# Altium project SmallyMouse2.PrjPcb
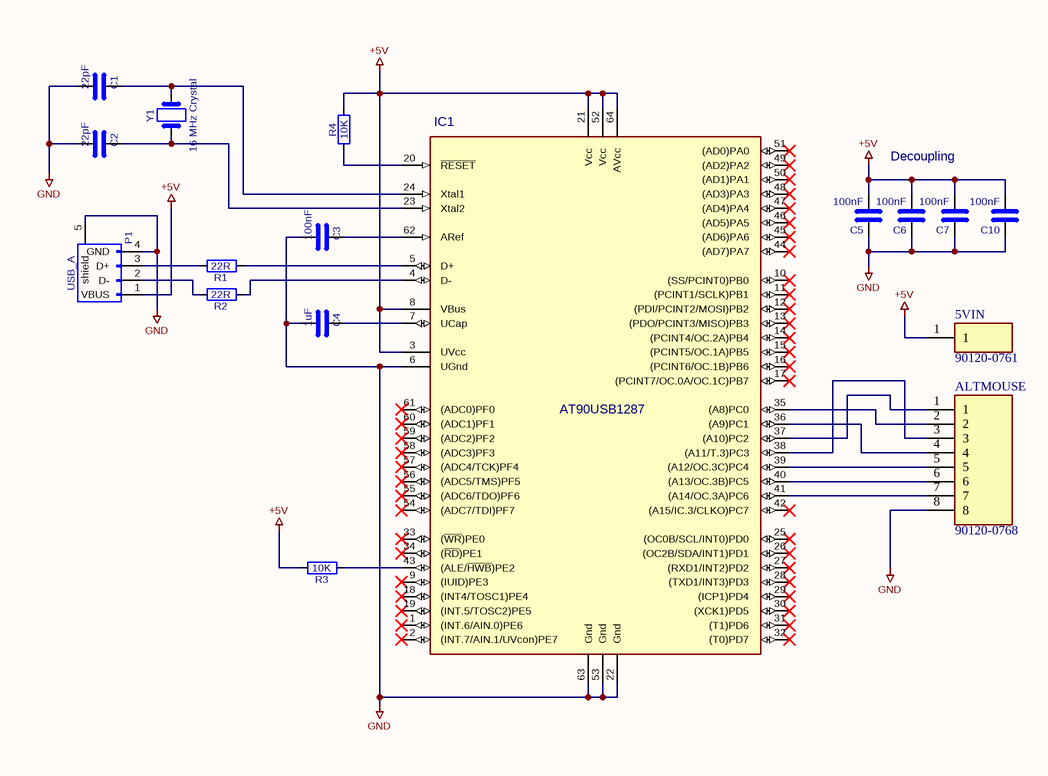
[diagram p0: SmallyMouse2.SchDoc]
1 sheet, 17 parts. Net scope: global (net labels, ports and power ports of the same name join across sheets).
Board file: SmallyMouse2.PcbDoc

## Sheet SmallyMouse2.SchDoc
size 297 x 210 mm

### Parts
5VIN  90120-0761  [HDRV1W90P0X254_1X1_232X249X560P]
ALTMOUSE  90120-0768  [HDRV8W90P0X254_1X8_2032X249X560P]
C1  22pF  [C_0805_HandSoldering]
C2  22pF  [C_0805_HandSoldering]
C3  100nF  [C_0805_HandSoldering]
C4  1uF  [C_0805_HandSoldering]
C5  100nF  [C_0805_HandSoldering]
C6  100nF  [C_0805_HandSoldering]
C7  100nF  [C_0805_HandSoldering]
C10  100nF  [C_0805_HandSoldering]
IC1  AT90USB1287  [TQFP-64_14x14mm_Pitch0.8mm]
P1  USB_A  [Amphenol_87583-2010BLF]
R1  22R  [R_0805_HandSoldering]
R2  22R  [R_0805_HandSoldering]
R3  10K  [R_0805_HandSoldering]
R4  10K  [R_0805_HandSoldering]
Y1  16 MHz Crystal  [Crystal_SMD_5032-2pin_5.0x3.2mm_HandSoldering]

### Nets
+5V: 5VIN.1 C5.2 C6.2 C7.2 C10.2 IC1.3(UVcc) IC1.8(VBus) IC1.21(Vcc) IC1.52(Vcc) IC1.64(AVcc) P1.1(VBUS) R3.2 R4.2
GND: ALTMOUSE.8 C1.2 C2.2 C3.2 C4.2 C5.1 C6.1 C7.1 C10.1 IC1.6(UGnd) IC1.22(Gnd) IC1.53(Gnd) IC1.63(Gnd) P1.4(GND) P1.5(shield)
NetALTMOUSE_1: ALTMOUSE.1 IC1.37((A10)PC2)
NetALTMOUSE_2: ALTMOUSE.2 IC1.35((A8)PC0)
NetALTMOUSE_3: ALTMOUSE.3 IC1.38((A11/T.3)PC3)
NetALTMOUSE_4: ALTMOUSE.4 IC1.36((A9)PC1)
NetALTMOUSE_5: ALTMOUSE.5 IC1.39((A12/OC.3C)PC4)
NetALTMOUSE_6: ALTMOUSE.6 IC1.40((A13/OC.3B)PC5)
NetALTMOUSE_7: ALTMOUSE.7 IC1.41((A14/OC.3A)PC6)
NetC1_1: C1.1 IC1.24(Xtal1) Y1.2
NetC2_1: C2.1 IC1.23(Xtal2) Y1.1
NetC3_1: C3.1 IC1.62(ARef)
NetC4_1: C4.1 IC1.7(UCap)
NetIC1_4: IC1.4(D-) R2.1
NetIC1_5: IC1.5(D+) R1.1
NetIC1_20: IC1.20(~{RESET}) R4.1
NetIC1_43: IC1.43((ALE/~{HWB})PE2) R3.1
NetP1_2: P1.2(D-) R2.2
NetP1_3: P1.3(D+) R1.2

Not connected (* = marked no-connect by the designer): IC1 1((INT.6/AIN.0)PE6)* 2((INT.7/AIN.1/UVcon)PE7)* 9((IUID)PE3)* 10((SS/PCINT0)PB0)* 11((PCINT1/SCLK)PB1)* 12((PDI/PCINT2/MOSI)PB2)* 13((PDO/PCINT3/MISO)PB3)* 14((PCINT4/OC.2A)PB4)* 15((PCINT5/OC.1A)PB5)* 16((PCINT6/OC.1B)PB6)* 17((PCINT7/OC.0A/OC.1C)PB7)* 18((INT4/TOSC1)PE4)* 19((INT.5/TOSC2)PE5)* 25((OC0B/SCL/INT0)PD0)* 26((OC2B/SDA/INT1)PD1)* 27((RXD1/INT2)PD2)* 28((TXD1/INT3)PD3)* 29((ICP1)PD4)* 30((XCK1)PD5)* 31((T1)PD6)* 32((T0)PD7)* 33((~{WR})PE0)* 34((~{RD})PE1)* 42((A15/IC.3/CLKO)PC7)* 44((AD7)PA7)* 45((AD6)PA6)* 46((AD5)PA5)* 47((AD4)PA4)* 48((AD3)PA3)* 49((AD2)PA2)* 50((AD1)PA1)* 51((AD0)PA0)* 54((ADC7/TDI)PF7)* 55((ADC6/TDO)PF6)* 56((ADC5/TMS)PF5)* 57((ADC4/TCK)PF4)* 58((ADC3)PF3)* 59((ADC2)PF2)* 60((ADC1)PF1)* 61((ADC0)PF0)*

### Notes on the sheet
- Decoupling
- 1
- 2
- 3
- 4
- 5
- 6
- A
- B
- C
- (c)2017 Simon Inns
- License: Attribution-ShareAlike 4.0 International (CC BY-SA 4.0)
- D
- Title: SmallyMouse2
- File: SmallyMouse2.sch
- Sheet: /
- http://www.WaitingForFriday.com
- KiCad E.D.A.  kicad (5.1.4)-1
- Size: A4
- Date: 2017-02-16
- Rev: 2.0
- Id: 1/1

### Library data of the parts
5VIN = 90120-0761: Connector; Manufacturer_Name: Molex; Datasheet Link: https://www.molex.com/pdm_docs/sd/901200761_sd.pdf; Height: 5.6mm; Manufacturer_Part_Number: 90120-0761; Mouser Part Number: 538-90120-0761; Mouser Price/Stock: https://www.mouser.co.uk/ProductDetail/Molex/90120-0761?qs=PvP5v7Eimsn%2F58TpDaAAow%3D%3D
ALTMOUSE = 90120-0768: Connector; Manufacturer_Name: Molex; Datasheet Link: http://www.molex.com/molex/products/datasheet.jsp?part=active/0901200768_PCB_HEADERS.xml; Height: 5.6mm; Manufacturer_Part_Number: 90120-0768; Mouser Part Number: 538-90120-0768; Mouser Price/Stock: https://www.mouser.co.uk/ProductDetail/Molex/90120-0768?qs=PvP5v7EimsmChj6ovxYE3w%3D%3D; Arrow Part Number: 90120-0768; Arrow Price/Stock: http://www.arrow.com/en/products/90120-0768/molex
C1-C7 C10 = C: Footprint: Capacitors_SMD:C_0805_HandSoldering
  C1 C2: Value: 22pF
  C3 C5-C7 C10: Value: 100nF
  C4: Value: 1uF
IC1 = AT90USB1287-RESCUE-SmallyMouse2: Value: AT90USB1287; Footprint: Housings_QFP:TQFP-64_14x14mm_Pitch0.8mm
P1 = USB_A-RESCUE-SmallyMouse2: Value: USB_A; Footprint: SimonsFPLibrary2017:Amphenol_87583-2010BLF
R1-R4 = R: Footprint: Resistors_SMD:R_0805_HandSoldering
  R1 R2: Value: 22R
  R3 R4: Value: 10K
Y1 = Crystal: Value: 16 MHz Crystal; Footprint: Crystals:Crystal_SMD_5032-2pin_5.0x3.2mm_HandSoldering